# Altium project ElektronischeSystemen2_Project.PrjPcb
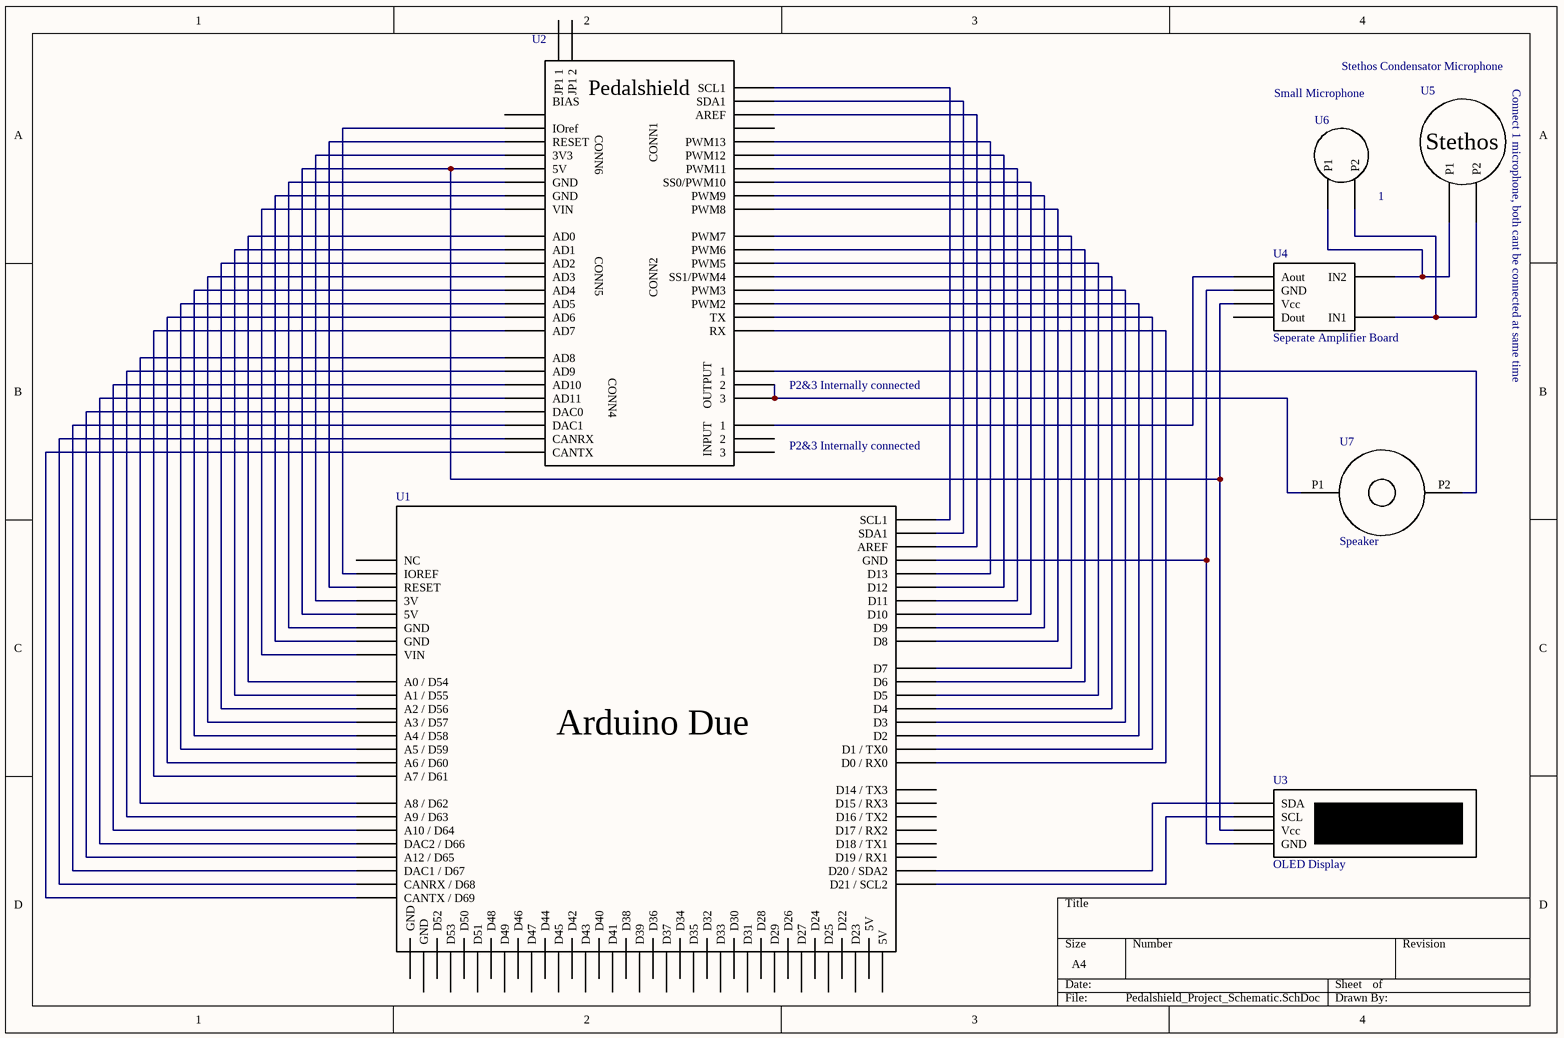
[diagram p0: Pedalshield_Project_Schematic.SchDoc]
1 sheet, 7 parts. Net scope: global (net labels, ports and power ports of the same name join across sheets).

## Sheet Pedalshield_Project_Schematic.SchDoc
size A4; SheetNumber: 1; SheetTotal: 1

### Parts
U1  Arduino Due  (value not drawn)
U2  1  (value not drawn)
U3  OLED Display
U4  Seperate Amplifier Board
U5  Stethos Condensator Microphone
U6  Small Microphone
U7  Speaker

### Nets
NetU1_16: U1.16(D13) U2.SDA78(PWM13)
NetU1_17: U1.17(D12) U2.SDA79(PWM12)
NetU1_18: U1.18(D11) U2.SDA80(PWM11)
NetU1_19: U1.19(D10) U2.SDA81(SS0/PWM10)
NetU1_20: U1.20(D9) U2.SDA116(PWM9)
NetU1_21: U1.21(D8) U2.SDA117(PWM8)
NetU1_22: U1.22(D7) U2.SDA82(PWM7)
NetU1_23: U1.23(D6) U2.SDA83(PWM6)
NetU1_24: U1.24(D5) U2.SDA84(PWM5)
NetU1_25: U1.25(D4) U2.SDA85(SS1/PWM4)
NetU1_26: U1.26(D3) U2.SDA86(PWM3)
NetU1_27: U1.27(D2) U2.SDA118(PWM2)
NetU1_28: U1.28(D1_/_TX0) U2.SDA87(TX)
NetU1_29: U1.29(D0_/_RX0) U2.SDA88(RX)
NetU1_36: U1.36(D20_/_SDA2) U3.SDA69(SDA)
NetU1_37: U1.37(D21_/_SCL2) U3.SDA70(SCL)
NetU1_AREF: U1.AREF U2.SDA76(AREF)
NetU1_GND: U1.GND U3.SDA72(GND) U4.SDA65(GND)
NetU1_SCL1: U1.SCL1 U2.SDA74(SCL1)
NetU1_SDA1: U1.SDA1 U2.SDA75(SDA1)
NetU1_SDA3: U1.SDA3(IOREF) U2.SDA101(IOref)
NetU1_SDA4: U1.SDA4(RESET) U2.SDA102(RESET)
NetU1_SDA5: U1.SDA5(3V) U2.SDA103(3V3)
NetU1_SDA6: U1.SDA6(5V) U2.SDA104(5V) U3.SDA71(Vcc) U4.SDA64(Vcc)
NetU1_SDA7: U1.SDA7(GND) U2.SDA105(GND)
NetU1_SDA8: U1.SDA8(GND) U2.SDA106(GND)
NetU1_SDA9: U1.SDA9(VIN) U2.SDA107(VIN)
NetU1_SDA11: U1.SDA11(A0_/_D54) U2.SDA108(AD0)
NetU1_SDA12: U1.SDA12(A1_/_D55) U2.SDA109(AD1)
NetU1_SDA13: U1.SDA13(A2_/_D56) U2.SDA110(AD2)
NetU1_SDA14: U1.SDA14(A3_/_D57) U2.SDA111(AD3)
NetU1_SDA15: U1.SDA15(A4_/_D58) U2.SDA112(AD4)
NetU1_SDA16: U1.SDA16(A5_/_D59) U2.SDA113(AD5)
NetU1_SDA17: U1.SDA17(A6_/_D60) U2.SDA114(AD6)
NetU1_SDA18: U1.SDA18(A7_/_D61) U2.SDA115(AD7)
NetU1_SDA20: U1.SDA20(A8_/_D62) U2.SDA97(AD8)
NetU1_SDA21: U1.SDA21(A9_/_D63) U2.SDA96(AD9)
NetU1_SDA22: U1.SDA22(A10_/_D64) U2.SDA95(AD10)
NetU1_SDA23: U1.SDA23(DAC2_/_D66) U2.SDA94(AD11)
NetU1_SDA24: U1.SDA24(A12_/_D65) U2.SDA93(DAC0)
NetU1_SDA25: U1.SDA25(DAC1_/_D67) U2.SDA92(DAC1)
NetU1_SDA26: U1.SDA26(CANRX_/_D68) U2.SDA91(CANRX)
NetU1_SDA27: U1.SDA27(CANTX_/_D69) U2.SDA90(CANTX)
NetU2_SDA119: U2.SDA119(1) U7.P2
NetU2_SDA120: U2.SDA120(2) U2.SDA121(3) U7.P1
NetU2_SDA122: U2.SDA122(1) U4.SDA66(Aout)
NetU4_SDA67: U4.SDA67(IN1) U5.SDA67(P2) U6.SDA67(P2)
NetU4_SDA68: U4.SDA68(IN2) U5.SDA68(P1) U6.SDA68(P1)

Not connected (* = marked no-connect by the designer): U1 30(D14_/_TX3) 31(D15_/_RX3) 32(D16_/_TX2) 33(D17_/_RX2) 34(D18_/_TX1) 35(D19_/_RX1) SDA2(NC) SDA28(5V) SDA29(5V) SDA30(D23) SDA31(D22) SDA32(D25) SDA33(D24) SDA34(D27) SDA35(D26) SDA36(D29) SDA37(D28) SDA38(D31) SDA39(D30) SDA40(D33) SDA41(D32) SDA42(D35) SDA43(D34) SDA44(D37) SDA45(D36) SDA46(D39) SDA47(D38) SDA48(D41) SDA49(D43) SDA50(D45) SDA51(D47) SDA52(D49) SDA53(D51) SDA54(D53) SDA55(GND) SDA56(D40) SDA57(D42) SDA58(D44) SDA59(D46) SDA60(D48) SDA61(D50) SDA62(D52); U2 SDA77 SDA98(JP1_1) SDA99(JP1_2) SDA100 SDA123(2) SDA124(3); U4 SDA63(Dout)

### Notes on the sheet
- (near U5) Connect 1 microphone, both cant be connected at same time
- (near U2) P2&3 Internally connected
- P2&3 Internally connected
- (in symbol Pedalshield) BIAS; CONN1; CONN6; CONN5; CONN2; OUTPUT; CONN4; INPUT
- (in symbol Stethos Condensator Microphone) Stethos

### Library data of the parts
U2 = Pedalshield